# EAGLE schematic CubePCB (EAGLE 8.3.2)

## Sheet 1 of 4: LEDs
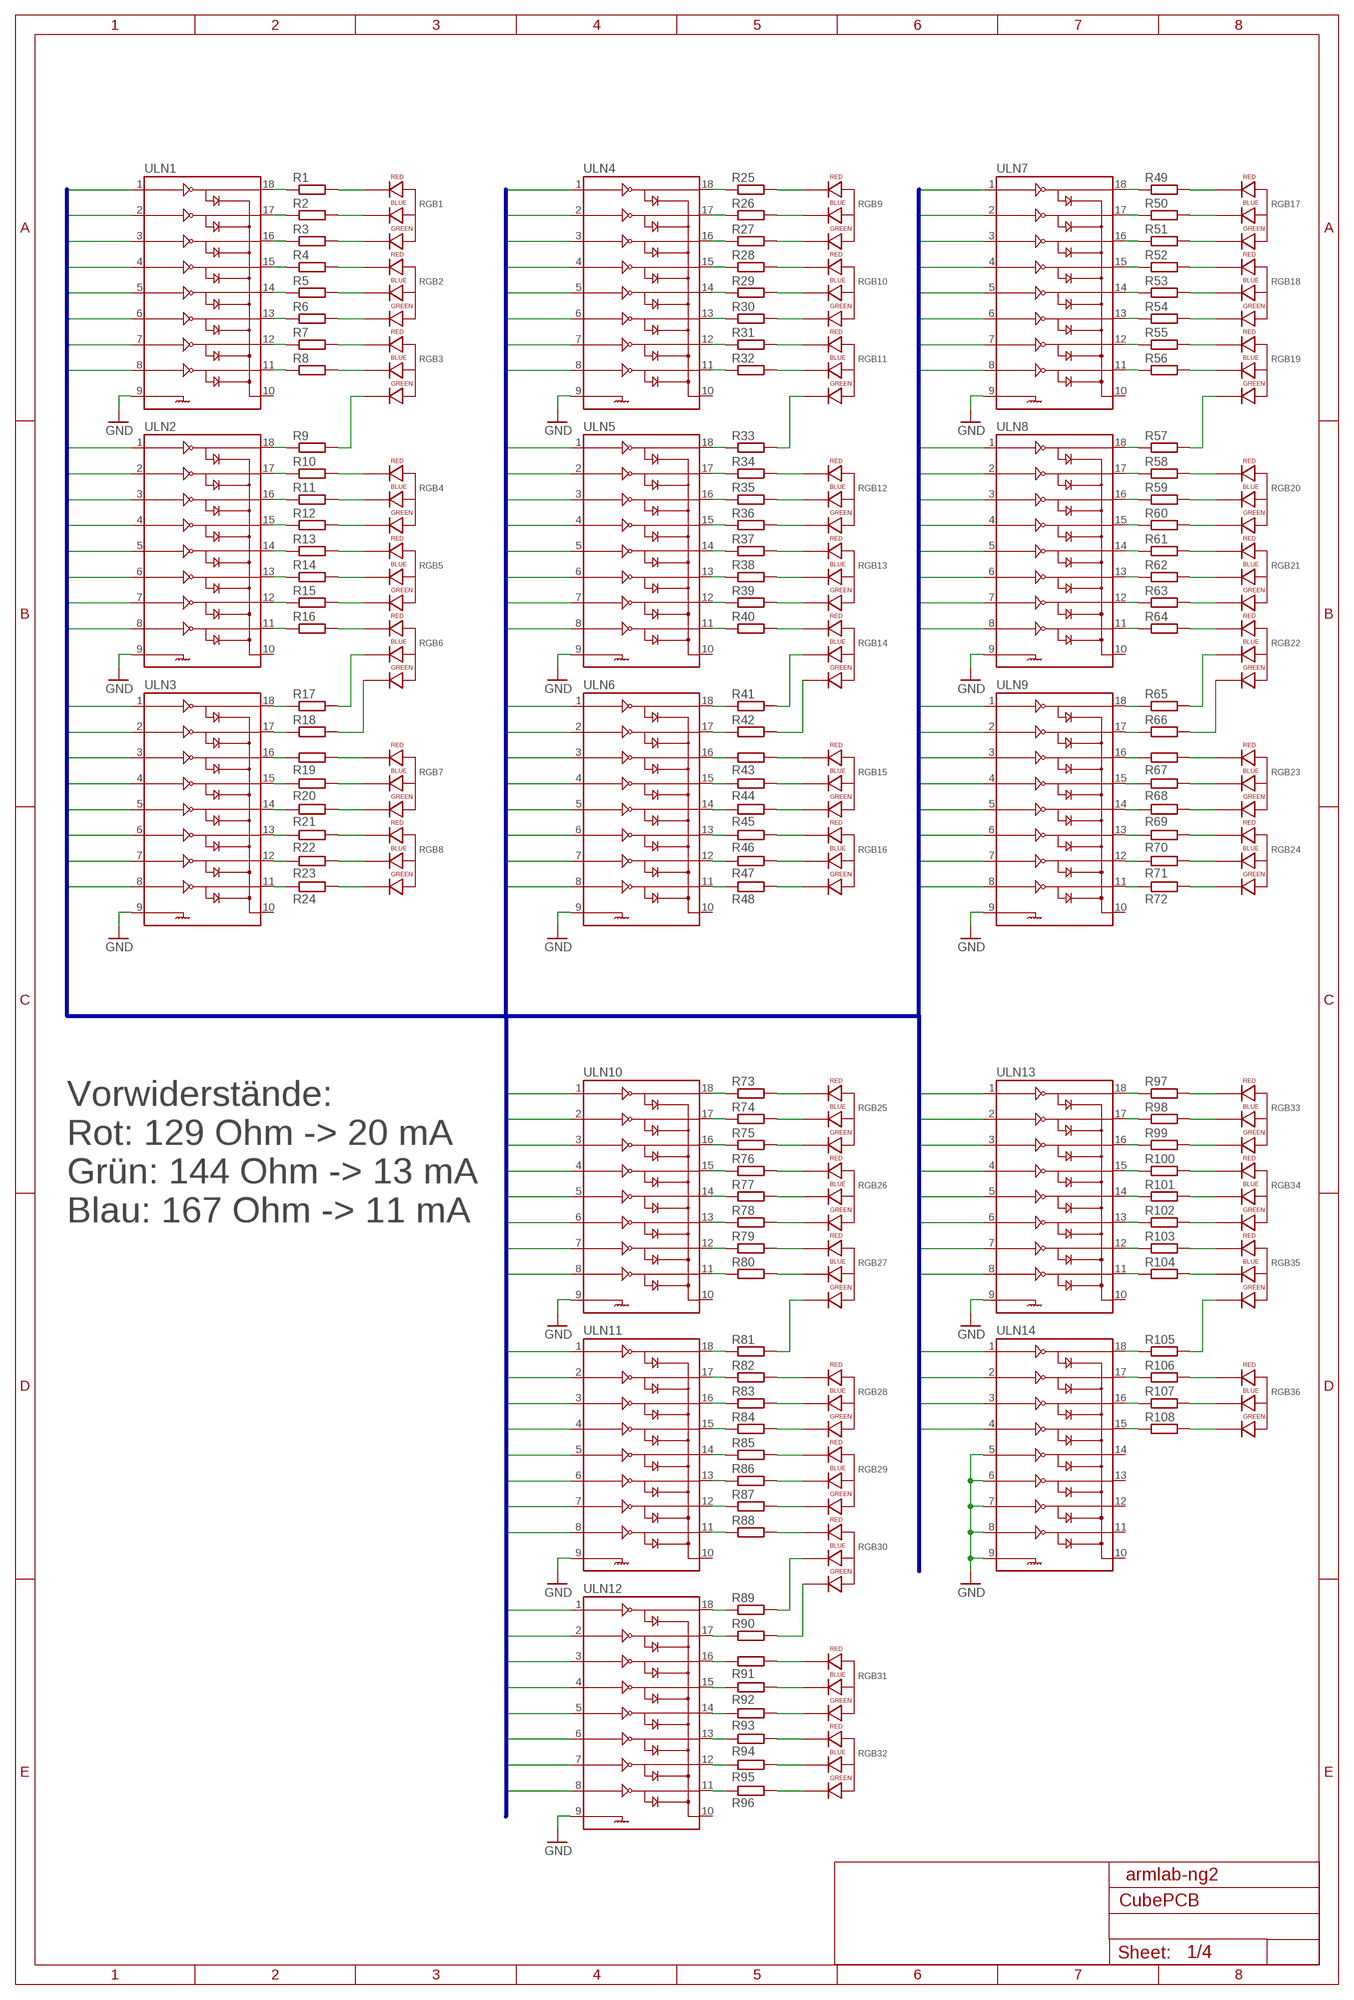
[diagram p0: schematic, sheet 1]

### Parts
R1  R-EU_R0603  [R0603]
R2  R-EU_R0603  [R0603]
R3  R-EU_R0603  [R0603]
R4  R-EU_R0603  [R0603]
R5  R-EU_R0603  [R0603]
R6  R-EU_R0603  [R0603]
R7  R-EU_R0603  [R0603]
R8  R-EU_R0603  [R0603]
R9  R-EU_R0603  [R0603]
R10  R-EU_R0603  [R0603]
R11  R-EU_R0603  [R0603]
R12  R-EU_R0603  [R0603]
R13  R-EU_R0603  [R0603]
R14  R-EU_R0603  [R0603]
R15  R-EU_R0603  [R0603]
R16  R-EU_R0603  [R0603]
R17  R-EU_R0603  [R0603]
R18  R-EU_R0603  [R0603]
R19  R-EU_R0603  [R0603]
R20  R-EU_R0603  [R0603]
R21  R-EU_R0603  [R0603]
R22  R-EU_R0603  [R0603]
R23  R-EU_R0603  [R0603]
R24  R-EU_R0603  [R0603]
R25  R-EU_R0603  [R0603]
R26  R-EU_R0603  [R0603]
R27  R-EU_R0603  [R0603]
R28  R-EU_R0603  [R0603]
R29  R-EU_R0603  [R0603]
R30  R-EU_R0603  [R0603]
R31  R-EU_R0603  [R0603]
R32  R-EU_R0603  [R0603]
R33  R-EU_R0603  [R0603]
R34  R-EU_R0603  [R0603]
R35  R-EU_R0603  [R0603]
R36  R-EU_R0603  [R0603]
R37  R-EU_R0603  [R0603]
R38  R-EU_R0603  [R0603]
R39  R-EU_R0603  [R0603]
R40  R-EU_R0603  [R0603]
R41  R-EU_R0603  [R0603]
R42  R-EU_R0603  [R0603]
R43  R-EU_R0603  [R0603]
R44  R-EU_R0603  [R0603]
R45  R-EU_R0603  [R0603]
R46  R-EU_R0603  [R0603]
R47  R-EU_R0603  [R0603]
R48  R-EU_R0603  [R0603]
R49  R-EU_R0603  [R0603]
R50  R-EU_R0603  [R0603]
R51  R-EU_R0603  [R0603]
R52  R-EU_R0603  [R0603]
R53  R-EU_R0603  [R0603]
R54  R-EU_R0603  [R0603]
R55  R-EU_R0603  [R0603]
R56  R-EU_R0603  [R0603]
R57  R-EU_R0603  [R0603]
R58  R-EU_R0603  [R0603]
R59  R-EU_R0603  [R0603]
R60  R-EU_R0603  [R0603]
R61  R-EU_R0603  [R0603]
R62  R-EU_R0603  [R0603]
R63  R-EU_R0603  [R0603]
R64  R-EU_R0603  [R0603]
R65  R-EU_R0603  [R0603]
R66  R-EU_R0603  [R0603]
R67  R-EU_R0603  [R0603]
R68  R-EU_R0603  [R0603]
R69  R-EU_R0603  [R0603]
R70  R-EU_R0603  [R0603]
R71  R-EU_R0603  [R0603]
R72  R-EU_R0603  [R0603]
R73  R-EU_R0603  [R0603]
R74  R-EU_R0603  [R0603]
R75  R-EU_R0603  [R0603]
R76  R-EU_R0603  [R0603]
R77  R-EU_R0603  [R0603]
R78  R-EU_R0603  [R0603]
R79  R-EU_R0603  [R0603]
R80  R-EU_R0603  [R0603]
R81  R-EU_R0603  [R0603]
R82  R-EU_R0603  [R0603]
R83  R-EU_R0603  [R0603]
R84  R-EU_R0603  [R0603]
R85  R-EU_R0603  [R0603]
R86  R-EU_R0603  [R0603]
R87  R-EU_R0603  [R0603]
R88  R-EU_R0603  [R0603]
R89  R-EU_R0603  [R0603]
R90  R-EU_R0603  [R0603]
R91  R-EU_R0603  [R0603]
R92  R-EU_R0603  [R0603]
R93  R-EU_R0603  [R0603]
R94  R-EU_R0603  [R0603]
R95  R-EU_R0603  [R0603]
R96  R-EU_R0603  [R0603]
R97  R-EU_R0603  [R0603]
R98  R-EU_R0603  [R0603]
R99  R-EU_R0603  [R0603]
R100  R-EU_R0603  [R0603]
R101  R-EU_R0603  [R0603]
R102  R-EU_R0603  [R0603]
R103  R-EU_R0603  [R0603]
R104  R-EU_R0603  [R0603]
R105  R-EU_R0603  [R0603]
R106  R-EU_R0603  [R0603]
R107  R-EU_R0603  [R0603]
R108  R-EU_R0603  [R0603]
RGB1  LED-RGB-CA-ANODE-SPLIT  [LED-RGB-WO-ANODE]
RGB2  LED-RGB-CA-ANODE-SPLIT  [LED-RGB-WO-ANODE]
RGB3  LED-RGB-CA-ANODE-SPLIT  [LED-RGB-WO-ANODE]
RGB4  LED-RGB-CA-ANODE-SPLIT  [LED-RGB-WO-ANODE]
RGB5  LED-RGB-CA-ANODE-SPLIT  [LED-RGB-WO-ANODE]
RGB6  LED-RGB-CA-ANODE-SPLIT  [LED-RGB-WO-ANODE]
RGB7  LED-RGB-CA-ANODE-SPLIT  [LED-RGB-WO-ANODE]
RGB8  LED-RGB-CA-ANODE-SPLIT  [LED-RGB-WO-ANODE]
RGB9  LED-RGB-CA-ANODE-SPLIT  [LED-RGB-WO-ANODE]
RGB10  LED-RGB-CA-ANODE-SPLIT  [LED-RGB-WO-ANODE]
RGB11  LED-RGB-CA-ANODE-SPLIT  [LED-RGB-WO-ANODE]
RGB12  LED-RGB-CA-ANODE-SPLIT  [LED-RGB-WO-ANODE]
RGB13  LED-RGB-CA-ANODE-SPLIT  [LED-RGB-WO-ANODE]
RGB14  LED-RGB-CA-ANODE-SPLIT  [LED-RGB-WO-ANODE]
RGB15  LED-RGB-CA-ANODE-SPLIT  [LED-RGB-WO-ANODE]
RGB16  LED-RGB-CA-ANODE-SPLIT  [LED-RGB-WO-ANODE]
RGB17  LED-RGB-CA-ANODE-SPLIT  [LED-RGB-WO-ANODE]
RGB18  LED-RGB-CA-ANODE-SPLIT  [LED-RGB-WO-ANODE]
RGB19  LED-RGB-CA-ANODE-SPLIT  [LED-RGB-WO-ANODE]
RGB20  LED-RGB-CA-ANODE-SPLIT  [LED-RGB-WO-ANODE]
RGB21  LED-RGB-CA-ANODE-SPLIT  [LED-RGB-WO-ANODE]
RGB22  LED-RGB-CA-ANODE-SPLIT  [LED-RGB-WO-ANODE]
RGB23  LED-RGB-CA-ANODE-SPLIT  [LED-RGB-WO-ANODE]
RGB24  LED-RGB-CA-ANODE-SPLIT  [LED-RGB-WO-ANODE]
RGB25  LED-RGB-CA-ANODE-SPLIT  [LED-RGB-WO-ANODE]
RGB26  LED-RGB-CA-ANODE-SPLIT  [LED-RGB-WO-ANODE]
RGB27  LED-RGB-CA-ANODE-SPLIT  [LED-RGB-WO-ANODE]
RGB28  LED-RGB-CA-ANODE-SPLIT  [LED-RGB-WO-ANODE]
RGB29  LED-RGB-CA-ANODE-SPLIT  [LED-RGB-WO-ANODE]
RGB30  LED-RGB-CA-ANODE-SPLIT  [LED-RGB-WO-ANODE]
RGB31  LED-RGB-CA-ANODE-SPLIT  [LED-RGB-WO-ANODE]
RGB32  LED-RGB-CA-ANODE-SPLIT  [LED-RGB-WO-ANODE]
RGB33  LED-RGB-CA-ANODE-SPLIT  [LED-RGB-WO-ANODE]
RGB34  LED-RGB-CA-ANODE-SPLIT  [LED-RGB-WO-ANODE]
RGB35  LED-RGB-CA-ANODE-SPLIT  [LED-RGB-WO-ANODE]
RGB36  LED-RGB-CA-ANODE-SPLIT  [LED-RGB-WO-ANODE]
ULN1  ULN2803SOICW  [SO18L]
ULN2  ULN2803SOICW  [SO18L]
ULN3  ULN2803SOICW  [SO18L]
ULN4  ULN2803SOICW  [SO18L]
ULN5  ULN2803SOICW  [SO18L]
ULN6  ULN2803SOICW  [SO18L]
ULN7  ULN2803SOICW  [SO18L]
ULN8  ULN2803SOICW  [SO18L]
ULN9  ULN2803SOICW  [SO18L]
ULN10  ULN2803SOICW  [SO18L]
ULN11  ULN2803SOICW  [SO18L]
ULN12  ULN2803SOICW  [SO18L]
ULN13  ULN2803SOICW  [SO18L]
ULN14  ULN2803SOICW  [SO18L]

### Nets
B1: ULN1.2 ; also sheet 3
B2: ULN1.5 ; also sheet 3
B3: ULN1.8 ; also sheet 3
B4: ULN2.3 ; also sheet 3
B5: ULN2.6 ; also sheet 3
B6: ULN3.1 ; also sheet 3
B7: ULN3.4 ; also sheet 3
B8: ULN3.7 ; also sheet 3
B9: ULN4.2 ; also sheet 3
B10: ULN4.5 ; also sheet 3
B11: ULN4.8 ; also sheet 3
B12: ULN5.3 ; also sheet 3
B13: ULN5.6 ; also sheet 3
B14: ULN6.1 ; also sheet 3
B15: ULN6.4 ; also sheet 3
B16: ULN6.7 ; also sheet 3
B17: ULN7.2 ; also sheet 3
B18: ULN7.5 ; also sheet 3
B19: ULN7.8 ; also sheet 3
B20: ULN8.3 ; also sheet 3
B21: ULN8.6 ; also sheet 3
B22: ULN9.1 ; also sheet 3
B23: ULN9.4 ; also sheet 3
B24: ULN9.7 ; also sheet 3
B25: ULN10.2 ; also sheet 3
B26: ULN10.5 ; also sheet 3
B27: ULN10.8 ; also sheet 3
B28: ULN11.3 ; also sheet 3
B29: ULN11.6 ; also sheet 3
B30: ULN12.1 ; also sheet 3
B31: ULN12.4 ; also sheet 3
B32: ULN12.7 ; also sheet 3
B33: ULN13.2 ; also sheet 3
B34: ULN13.5 ; also sheet 3
B35: ULN13.8 ; also sheet 3
B36: ULN14.3 ; also sheet 3
G1: ULN1.3 ; also sheet 3
G2: ULN1.6 ; also sheet 3
G3: ULN2.1 ; also sheet 3
G4: ULN2.4 ; also sheet 3
G5: ULN2.7 ; also sheet 3
G6: ULN3.2 ; also sheet 3
G7: ULN3.5 ; also sheet 3
G8: ULN3.8 ; also sheet 3
G9: ULN4.3 ; also sheet 3
G10: ULN4.6 ; also sheet 3
G11: ULN5.1 ; also sheet 3
G12: ULN5.4 ; also sheet 3
G13: ULN5.7 ; also sheet 3
G14: ULN6.2 ; also sheet 3
G15: ULN6.5 ; also sheet 3
G16: ULN6.8 ; also sheet 3
G17: ULN7.3 ; also sheet 3
G18: ULN7.6 ; also sheet 3
G19: ULN8.1 ; also sheet 3
G20: ULN8.4 ; also sheet 3
G21: ULN8.7 ; also sheet 3
G22: ULN9.2 ; also sheet 3
G23: ULN9.5 ; also sheet 3
G24: ULN9.8 ; also sheet 3
G25: ULN10.3 ; also sheet 3
G26: ULN10.6 ; also sheet 3
G27: ULN11.1 ; also sheet 3
G28: ULN11.4 ; also sheet 3
G29: ULN11.7 ; also sheet 3
G30: ULN12.2 ; also sheet 3
G31: ULN12.5 ; also sheet 3
G32: ULN12.8 ; also sheet 3
G33: ULN13.3 ; also sheet 3
G34: ULN13.6 ; also sheet 3
G35: ULN14.1 ; also sheet 3
G36: ULN14.4 ; also sheet 3
GND: ULN1.9 ULN2.9 ULN3.9 ULN4.9 ULN5.9 ULN6.9 ULN7.9 ULN8.9 ULN9.9 ULN10.9 ULN11.9 ULN12.9 ULN13.9 ULN14.5 ULN14.6 ULN14.7 ULN14.8 ULN14.9 ; also sheet 2,3,4
N$1: R1.1 ULN1.18
N$2: R2.1 ULN1.17
N$3: R3.1 ULN1.16
N$4: R3.2 RGB1.G(GREEN_CATHODE)
N$5: R2.2 RGB1.B(BLUE_CATHODE)
N$6: R1.2 RGB1.R(RED_CATHODE)
N$7: R4.1 ULN1.15
N$8: R5.1 ULN1.14
N$9: R6.1 ULN1.13
N$10: R7.1 ULN1.12
N$11: R6.2 RGB2.G(GREEN_CATHODE)
N$12: R5.2 RGB2.B(BLUE_CATHODE)
N$13: R4.2 RGB2.R(RED_CATHODE)
N$14: R8.1 ULN1.11
N$15: R19.1 ULN3.16
N$16: R20.1 ULN3.15
N$17: R9.2 RGB3.G(GREEN_CATHODE)
N$18: R8.2 RGB3.B(BLUE_CATHODE)
N$19: R7.2 RGB3.R(RED_CATHODE)
N$20: R21.1 ULN3.14
N$21: R22.1 ULN3.13
N$22: R23.1 ULN3.12
N$23: R12.2 RGB4.G(GREEN_CATHODE)
N$24: R11.2 RGB4.B(BLUE_CATHODE)
N$25: R10.2 RGB4.R(RED_CATHODE)
N$26: R24.1 ULN3.11
N$27: R27.2 RGB9.G(GREEN_CATHODE)
N$28: R26.2 RGB9.B(BLUE_CATHODE)
N$29: R15.2 RGB5.G(GREEN_CATHODE)
N$30: R14.2 RGB5.B(BLUE_CATHODE)
N$31: R13.2 RGB5.R(RED_CATHODE)
N$32: R25.2 RGB9.R(RED_CATHODE)
N$33: R30.2 RGB10.G(GREEN_CATHODE)
N$34: R29.2 RGB10.B(BLUE_CATHODE)
N$35: R18.2 RGB6.G(GREEN_CATHODE)
N$36: R17.2 RGB6.B(BLUE_CATHODE)
N$37: R16.2 RGB6.R(RED_CATHODE)
N$38: R28.2 RGB10.R(RED_CATHODE)
N$39: R33.2 RGB11.G(GREEN_CATHODE)
N$40: R32.2 RGB11.B(BLUE_CATHODE)
N$41: R31.2 RGB11.R(RED_CATHODE)
N$42: R36.2 RGB12.G(GREEN_CATHODE)
N$43: R35.2 RGB12.B(BLUE_CATHODE)
N$44: R34.2 RGB12.R(RED_CATHODE)
N$45: R19.2 RGB7.R(RED_CATHODE)
N$46: R20.2 RGB7.B(BLUE_CATHODE)
N$47: R21.2 RGB7.G(GREEN_CATHODE)
N$48: R22.2 RGB8.R(RED_CATHODE)
N$49: R23.2 RGB8.B(BLUE_CATHODE)
N$50: R24.2 RGB8.G(GREEN_CATHODE)
N$51: R39.2 RGB13.G(GREEN_CATHODE)
N$52: R38.2 RGB13.B(BLUE_CATHODE)
N$53: R9.1 ULN2.18
N$54: R10.1 ULN2.17
N$55: R11.1 ULN2.16
N$56: R12.1 ULN2.15
N$57: R13.1 ULN2.14
N$58: R14.1 ULN2.13
N$59: R15.1 ULN2.12
N$60: R16.1 ULN2.11
N$61: R17.1 ULN3.18
N$62: R18.1 ULN3.17
N$63: R37.2 RGB13.R(RED_CATHODE)
N$64: R42.2 RGB14.G(GREEN_CATHODE)
N$65: R41.2 RGB14.B(BLUE_CATHODE)
N$66: R40.2 RGB14.R(RED_CATHODE)
N$67: R25.1 ULN4.18
N$68: R26.1 ULN4.17
N$69: R27.1 ULN4.16
N$70: R28.1 ULN4.15
N$71: R29.1 ULN4.14
N$72: R30.1 ULN4.13
N$73: R31.1 ULN4.12
N$74: R32.1 ULN4.11
N$75: R33.1 ULN5.18
N$76: R34.1 ULN5.17
N$77: R35.1 ULN5.16
N$78: R36.1 ULN5.15
N$79: R37.1 ULN5.14
N$80: R38.1 ULN5.13
N$81: R39.1 ULN5.12
N$82: R40.1 ULN5.11
N$83: R41.1 ULN6.18
N$84: R42.1 ULN6.17
N$85: R43.1 ULN6.16
N$86: R44.1 ULN6.15
N$87: R45.1 ULN6.14
N$88: R46.1 ULN6.13
N$89: R47.1 ULN6.12
N$90: R48.1 ULN6.11
N$91: R43.2 RGB15.R(RED_CATHODE)
N$92: R44.2 RGB15.B(BLUE_CATHODE)
N$93: R45.2 RGB15.G(GREEN_CATHODE)
N$94: R46.2 RGB16.R(RED_CATHODE)
N$95: R47.2 RGB16.B(BLUE_CATHODE)
N$96: R48.2 RGB16.G(GREEN_CATHODE)
N$97: R51.2 RGB17.G(GREEN_CATHODE)
N$98: R50.2 RGB17.B(BLUE_CATHODE)
N$99: R49.2 RGB17.R(RED_CATHODE)
N$100: R54.2 RGB18.G(GREEN_CATHODE)
N$101: R53.2 RGB18.B(BLUE_CATHODE)
N$102: R52.2 RGB18.R(RED_CATHODE)
N$103: R57.2 RGB19.G(GREEN_CATHODE)
N$104: R56.2 RGB19.B(BLUE_CATHODE)
N$105: R55.2 RGB19.R(RED_CATHODE)
N$106: R60.2 RGB20.G(GREEN_CATHODE)
N$107: R59.2 RGB20.B(BLUE_CATHODE)
N$108: R58.2 RGB20.R(RED_CATHODE)
N$109: R63.2 RGB21.G(GREEN_CATHODE)
N$110: R62.2 RGB21.B(BLUE_CATHODE)
N$111: R61.2 RGB21.R(RED_CATHODE)
N$112: R66.2 RGB22.G(GREEN_CATHODE)
N$113: R65.2 RGB22.B(BLUE_CATHODE)
N$114: R64.2 RGB22.R(RED_CATHODE)
N$115: R49.1 ULN7.18
N$116: R50.1 ULN7.17
N$117: R51.1 ULN7.16
N$118: R52.1 ULN7.15
N$119: R53.1 ULN7.14
N$120: R54.1 ULN7.13
N$121: R55.1 ULN7.12
N$122: R56.1 ULN7.11
N$123: R57.1 ULN8.18
N$124: R58.1 ULN8.17
N$125: R59.1 ULN8.16
N$126: R60.1 ULN8.15
N$127: R61.1 ULN8.14
N$128: R62.1 ULN8.13
N$129: R63.1 ULN8.12
N$130: R64.1 ULN8.11
N$131: R65.1 ULN9.18
N$132: R66.1 ULN9.17
N$133: R67.1 ULN9.16
N$134: R68.1 ULN9.15
N$135: R69.1 ULN9.14
N$136: R70.1 ULN9.13
N$137: R71.1 ULN9.12
N$138: R72.1 ULN9.11
N$139: R67.2 RGB23.R(RED_CATHODE)
N$140: R68.2 RGB23.B(BLUE_CATHODE)
N$141: R69.2 RGB23.G(GREEN_CATHODE)
N$142: R70.2 RGB24.R(RED_CATHODE)
N$143: R71.2 RGB24.B(BLUE_CATHODE)
N$144: R72.2 RGB24.G(GREEN_CATHODE)
N$145: R75.2 RGB25.G(GREEN_CATHODE)
N$146: R74.2 RGB25.B(BLUE_CATHODE)
N$147: R73.2 RGB25.R(RED_CATHODE)
N$148: R78.2 RGB26.G(GREEN_CATHODE)
N$149: R77.2 RGB26.B(BLUE_CATHODE)
N$150: R76.2 RGB26.R(RED_CATHODE)
N$151: R81.2 RGB27.G(GREEN_CATHODE)
N$152: R80.2 RGB27.B(BLUE_CATHODE)
N$153: R79.2 RGB27.R(RED_CATHODE)
N$154: R84.2 RGB28.G(GREEN_CATHODE)
N$155: R83.2 RGB28.B(BLUE_CATHODE)
N$156: R82.2 RGB28.R(RED_CATHODE)
N$157: R87.2 RGB29.G(GREEN_CATHODE)
N$158: R86.2 RGB29.B(BLUE_CATHODE)
N$159: R85.2 RGB29.R(RED_CATHODE)
N$160: R90.2 RGB30.G(GREEN_CATHODE)
N$161: R89.2 RGB30.B(BLUE_CATHODE)
N$162: R88.2 RGB30.R(RED_CATHODE)
N$163: R73.1 ULN10.18
N$164: R74.1 ULN10.17
N$165: R75.1 ULN10.16
N$166: R76.1 ULN10.15
N$167: R77.1 ULN10.14
N$168: R78.1 ULN10.13
N$169: R79.1 ULN10.12
N$170: R80.1 ULN10.11
N$171: R81.1 ULN11.18
N$172: R82.1 ULN11.17
N$173: R83.1 ULN11.16
N$174: R84.1 ULN11.15
N$175: R85.1 ULN11.14
N$176: R86.1 ULN11.13
N$177: R87.1 ULN11.12
N$178: R88.1 ULN11.11
N$179: R89.1 ULN12.18
N$180: R90.1 ULN12.17
N$181: R91.1 ULN12.16
N$182: R92.1 ULN12.15
N$183: R93.1 ULN12.14
N$184: R94.1 ULN12.13
N$185: R95.1 ULN12.12
N$186: R96.1 ULN12.11
N$187: R91.2 RGB31.R(RED_CATHODE)
N$188: R92.2 RGB31.B(BLUE_CATHODE)
N$189: R93.2 RGB31.G(GREEN_CATHODE)
N$190: R94.2 RGB32.R(RED_CATHODE)
N$191: R95.2 RGB32.B(BLUE_CATHODE)
N$192: R96.2 RGB32.G(GREEN_CATHODE)
N$193: R99.2 RGB33.G(GREEN_CATHODE)
N$194: R98.2 RGB33.B(BLUE_CATHODE)
N$195: R97.2 RGB33.R(RED_CATHODE)
N$196: R102.2 RGB34.G(GREEN_CATHODE)
N$197: R101.2 RGB34.B(BLUE_CATHODE)
N$198: R100.2 RGB34.R(RED_CATHODE)
N$199: R105.2 RGB35.G(GREEN_CATHODE)
N$200: R104.2 RGB35.B(BLUE_CATHODE)
N$201: R103.2 RGB35.R(RED_CATHODE)
N$202: R108.2 RGB36.G(GREEN_CATHODE)
N$203: R107.2 RGB36.B(BLUE_CATHODE)
N$204: R106.2 RGB36.R(RED_CATHODE)
N$211: R97.1 ULN13.18
N$212: R98.1 ULN13.17
N$213: R99.1 ULN13.16
N$214: R100.1 ULN13.15
N$215: R101.1 ULN13.14
N$216: R102.1 ULN13.13
N$217: R103.1 ULN13.12
N$218: R104.1 ULN13.11
N$219: R105.1 ULN14.18
N$220: R106.1 ULN14.17
N$221: R107.1 ULN14.16
N$222: R108.1 ULN14.15
R1: ULN1.1 ; also sheet 3
R2: ULN1.4 ; also sheet 3
R3: ULN1.7 ; also sheet 3
R4: ULN2.2 ; also sheet 3
R5: ULN2.5 ; also sheet 3
R6: ULN2.8 ; also sheet 3
R7: ULN3.3 ; also sheet 3
R8: ULN3.6 ; also sheet 3
R9: ULN4.1 ; also sheet 3
R10: ULN4.4 ; also sheet 3
R11: ULN4.7 ; also sheet 3
R12: ULN5.2 ; also sheet 3
R13: ULN5.5 ; also sheet 3
R14: ULN5.8 ; also sheet 3
R15: ULN6.3 ; also sheet 3
R16: ULN6.6 ; also sheet 3
R17: ULN7.1 ; also sheet 3
R18: ULN7.4 ; also sheet 3
R19: ULN7.7 ; also sheet 3
R20: ULN8.2 ; also sheet 3
R21: ULN8.5 ; also sheet 3
R22: ULN8.8 ; also sheet 3
R23: ULN9.3 ; also sheet 3
R24: ULN9.6 ; also sheet 3
R25: ULN10.1 ; also sheet 3
R26: ULN10.4 ; also sheet 3
R27: ULN10.7 ; also sheet 3
R28: ULN11.2 ; also sheet 3
R29: ULN11.5 ; also sheet 3
R30: ULN11.8 ; also sheet 3
R31: ULN12.3 ; also sheet 3
R32: ULN12.6 ; also sheet 3
R33: ULN13.1 ; also sheet 3
R34: ULN13.4 ; also sheet 3
R35: ULN13.7 ; also sheet 3
R36: ULN14.2 ; also sheet 3
Unconnected: ULN1.10 ULN2.10 ULN3.10 ULN4.10 ULN5.10 ULN6.10 ULN7.10 ULN8.10 ULN9.10 ULN10.10 ULN11.10 ULN12.10 ULN13.10 ULN14.10 ULN14.11 ULN14.12 ULN14.13 ULN14.14

### Buses
LED_BUS:R[1..36],G[1..36],B[1..36],+5V,GND

### Notes on the sheet
- Vorwiderstände:
  Rot: 129 Ohm -> 20 mA
  Grün: 144 Ohm -> 13 mA
  Blau: 167 Ohm -> 11 mA
- armlab-ng2

## Sheet 2 of 4: Ebenen
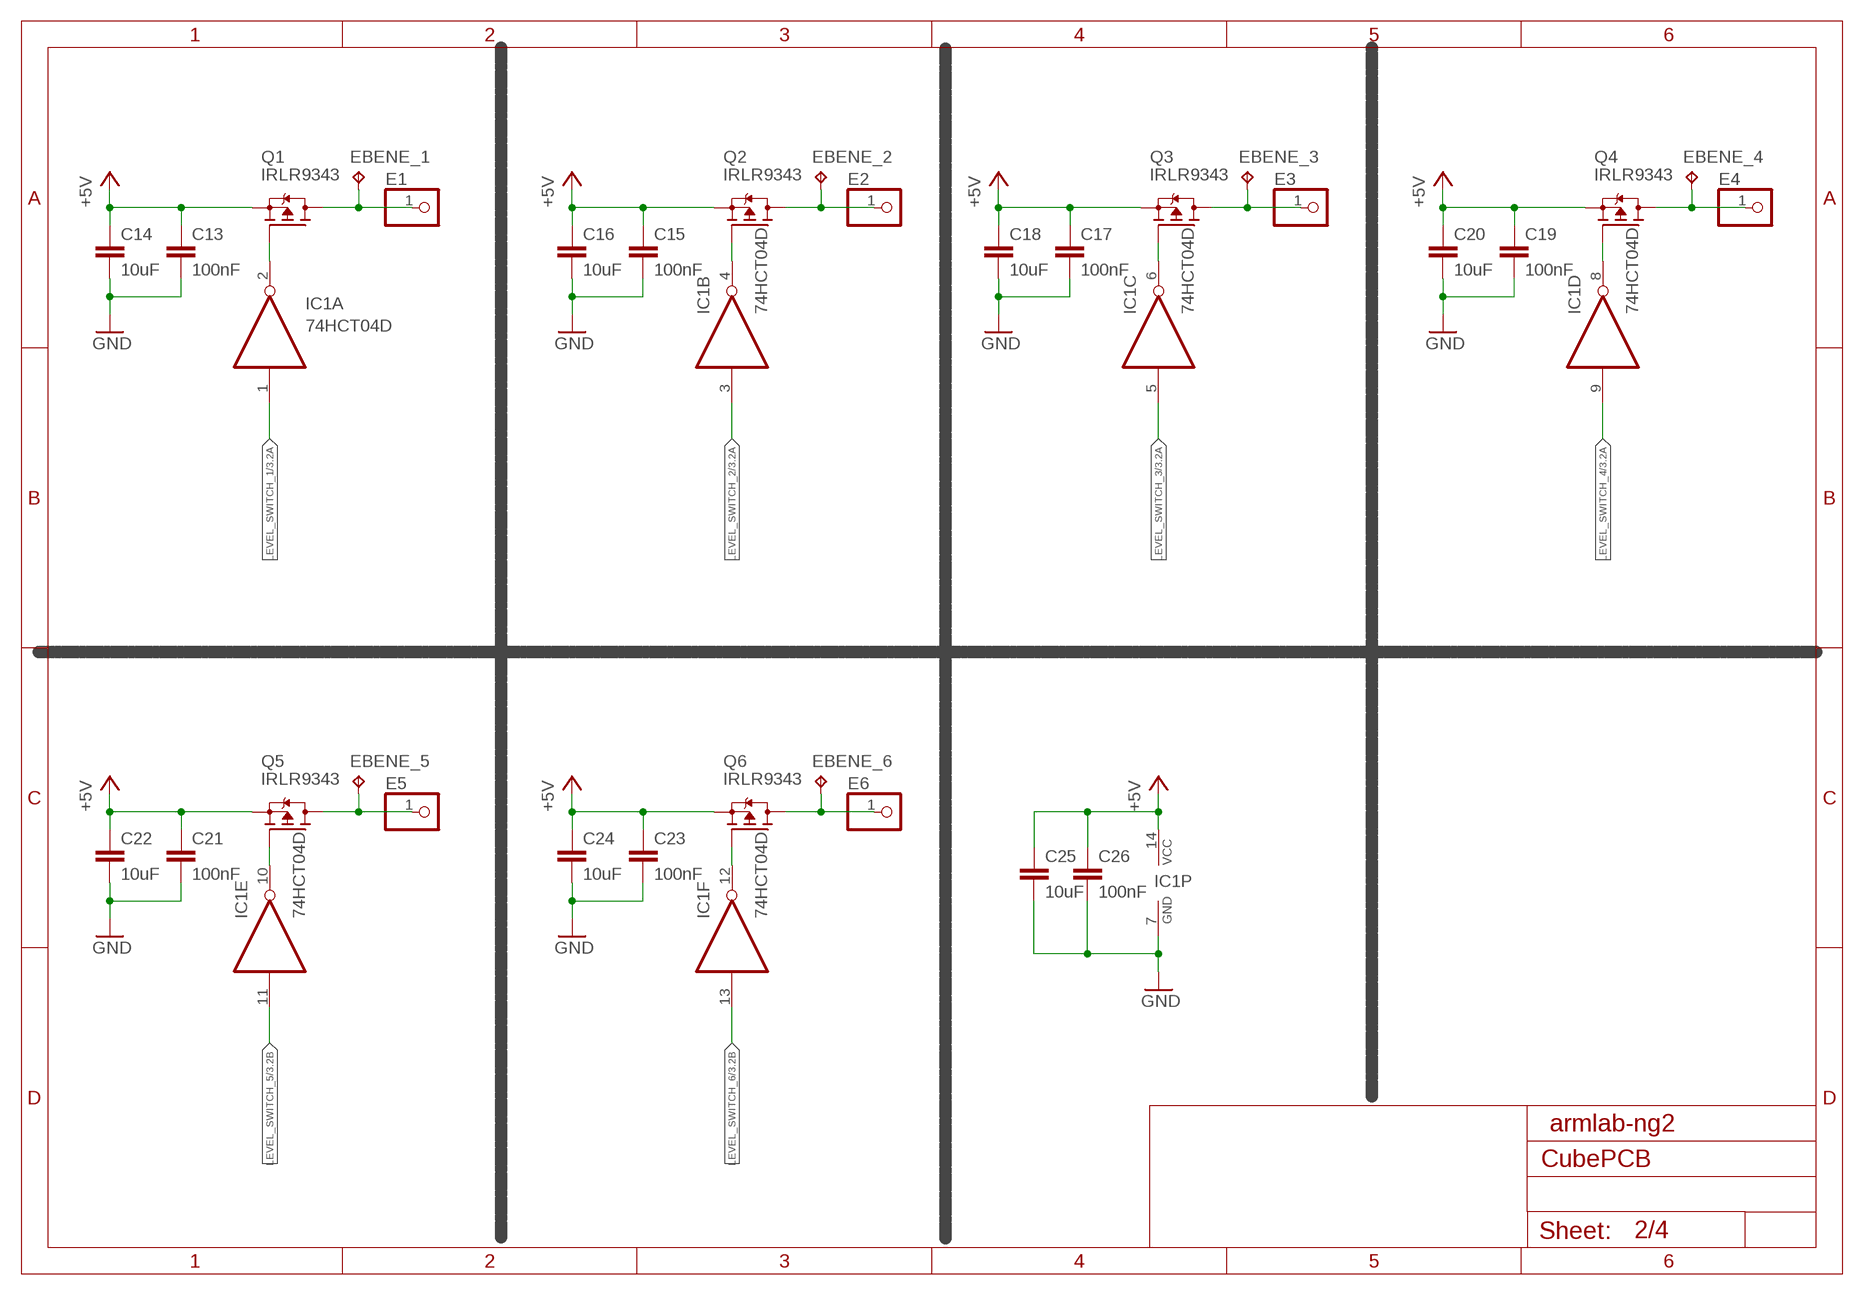
[diagram p1: schematic, sheet 2]

### Parts
C13  100nF  C-EUC0603K  [C0603K]
C14  10uF  C-EUC0603K  [C0603K]
C15  100nF  C-EUC0603K  [C0603K]
C16  10uF  C-EUC0603K  [C0603K]
C17  100nF  C-EUC0603K  [C0603K]
C18  10uF  C-EUC0603K  [C0603K]
C19  100nF  C-EUC0603K  [C0603K]
C20  10uF  C-EUC0603K  [C0603K]
C21  100nF  C-EUC0603K  [C0603K]
C22  10uF  C-EUC0603K  [C0603K]
C23  100nF  C-EUC0603K  [C0603K]
C24  10uF  C-EUC0603K  [C0603K]
C25  10uF  C-EUC0603K  [C0603K]
C26  100nF  C-EUC0603K  [C0603K]
E1  PINHD-1X1/LONG  [1X01]
E2  PINHD-1X1/LONG  [1X01]
E3  PINHD-1X1/LONG  [1X01]
E4  PINHD-1X1/LONG  [1X01]
E5  PINHD-1X1/LONG  [1X01]
E6  PINHD-1X1/LONG  [1X01]
EBENE_1  TPB1,27  [B1,27]
EBENE_2  TPB1,27  [B1,27]
EBENE_3  TPB1,27  [B1,27]
EBENE_4  TPB1,27  [B1,27]
EBENE_5  TPB1,27  [B1,27]
EBENE_6  TPB1,27  [B1,27]
IC1  74HCT04D  [SO14]
Q1  IRLR9343  FDD4141TO252  [TO252]
Q2  IRLR9343  FDD4141TO252  [TO252]
Q3  IRLR9343  FDD4141TO252  [TO252]
Q4  IRLR9343  FDD4141TO252  [TO252]
Q5  IRLR9343  FDD4141TO252  [TO252]
Q6  IRLR9343  FDD4141TO252  [TO252]

### Nets
+5V: C13.1 C14.1 C15.1 C16.1 C17.1 C18.1 C19.1 C20.1 C21.1 C22.1 C23.1 C24.1 C25.1 C26.1 IC1.14(P:VCC) Q1.2(S) Q2.2(S) Q3.2(S) Q4.2(S) Q5.2(S) Q6.2(S) ; also sheet 4
EBENE_1: E1.1 EBENE_1.TP Q1.3(D)
EBENE_2: E2.1 EBENE_2.TP Q2.3(D)
EBENE_3: E3.1 EBENE_3.TP Q3.3(D)
EBENE_4: E4.1 EBENE_4.TP Q4.3(D)
EBENE_5: E5.1 EBENE_5.TP Q5.3(D)
EBENE_6: E6.1 EBENE_6.TP Q6.3(D)
GND: C13.2 C14.2 C15.2 C16.2 C17.2 C18.2 C19.2 C20.2 C21.2 C22.2 C23.2 C24.2 C25.2 C26.2 IC1.7(P:GND) ; also sheet 1,3,4
LEVEL_SWITCH_1: IC1.1(A:I) ; also sheet 3
LEVEL_SWITCH_2: IC1.3(B:I) ; also sheet 3
LEVEL_SWITCH_3: IC1.5(C:I) ; also sheet 3
LEVEL_SWITCH_4: IC1.9(D:I) ; also sheet 3
LEVEL_SWITCH_5: IC1.11(E:I) ; also sheet 3
LEVEL_SWITCH_6: IC1.13(F:I) ; also sheet 3
N$205: IC1.4(B:O) Q2.1(G)
N$206: IC1.2(A:O) Q1.1(G)
N$207: IC1.6(C:O) Q3.1(G)
N$208: IC1.8(D:O) Q4.1(G)
N$209: IC1.10(E:O) Q5.1(G)
N$210: IC1.12(F:O) Q6.1(G)

### Notes on the sheet
- armlab-ng2

## Sheet 3 of 4: Connectoren
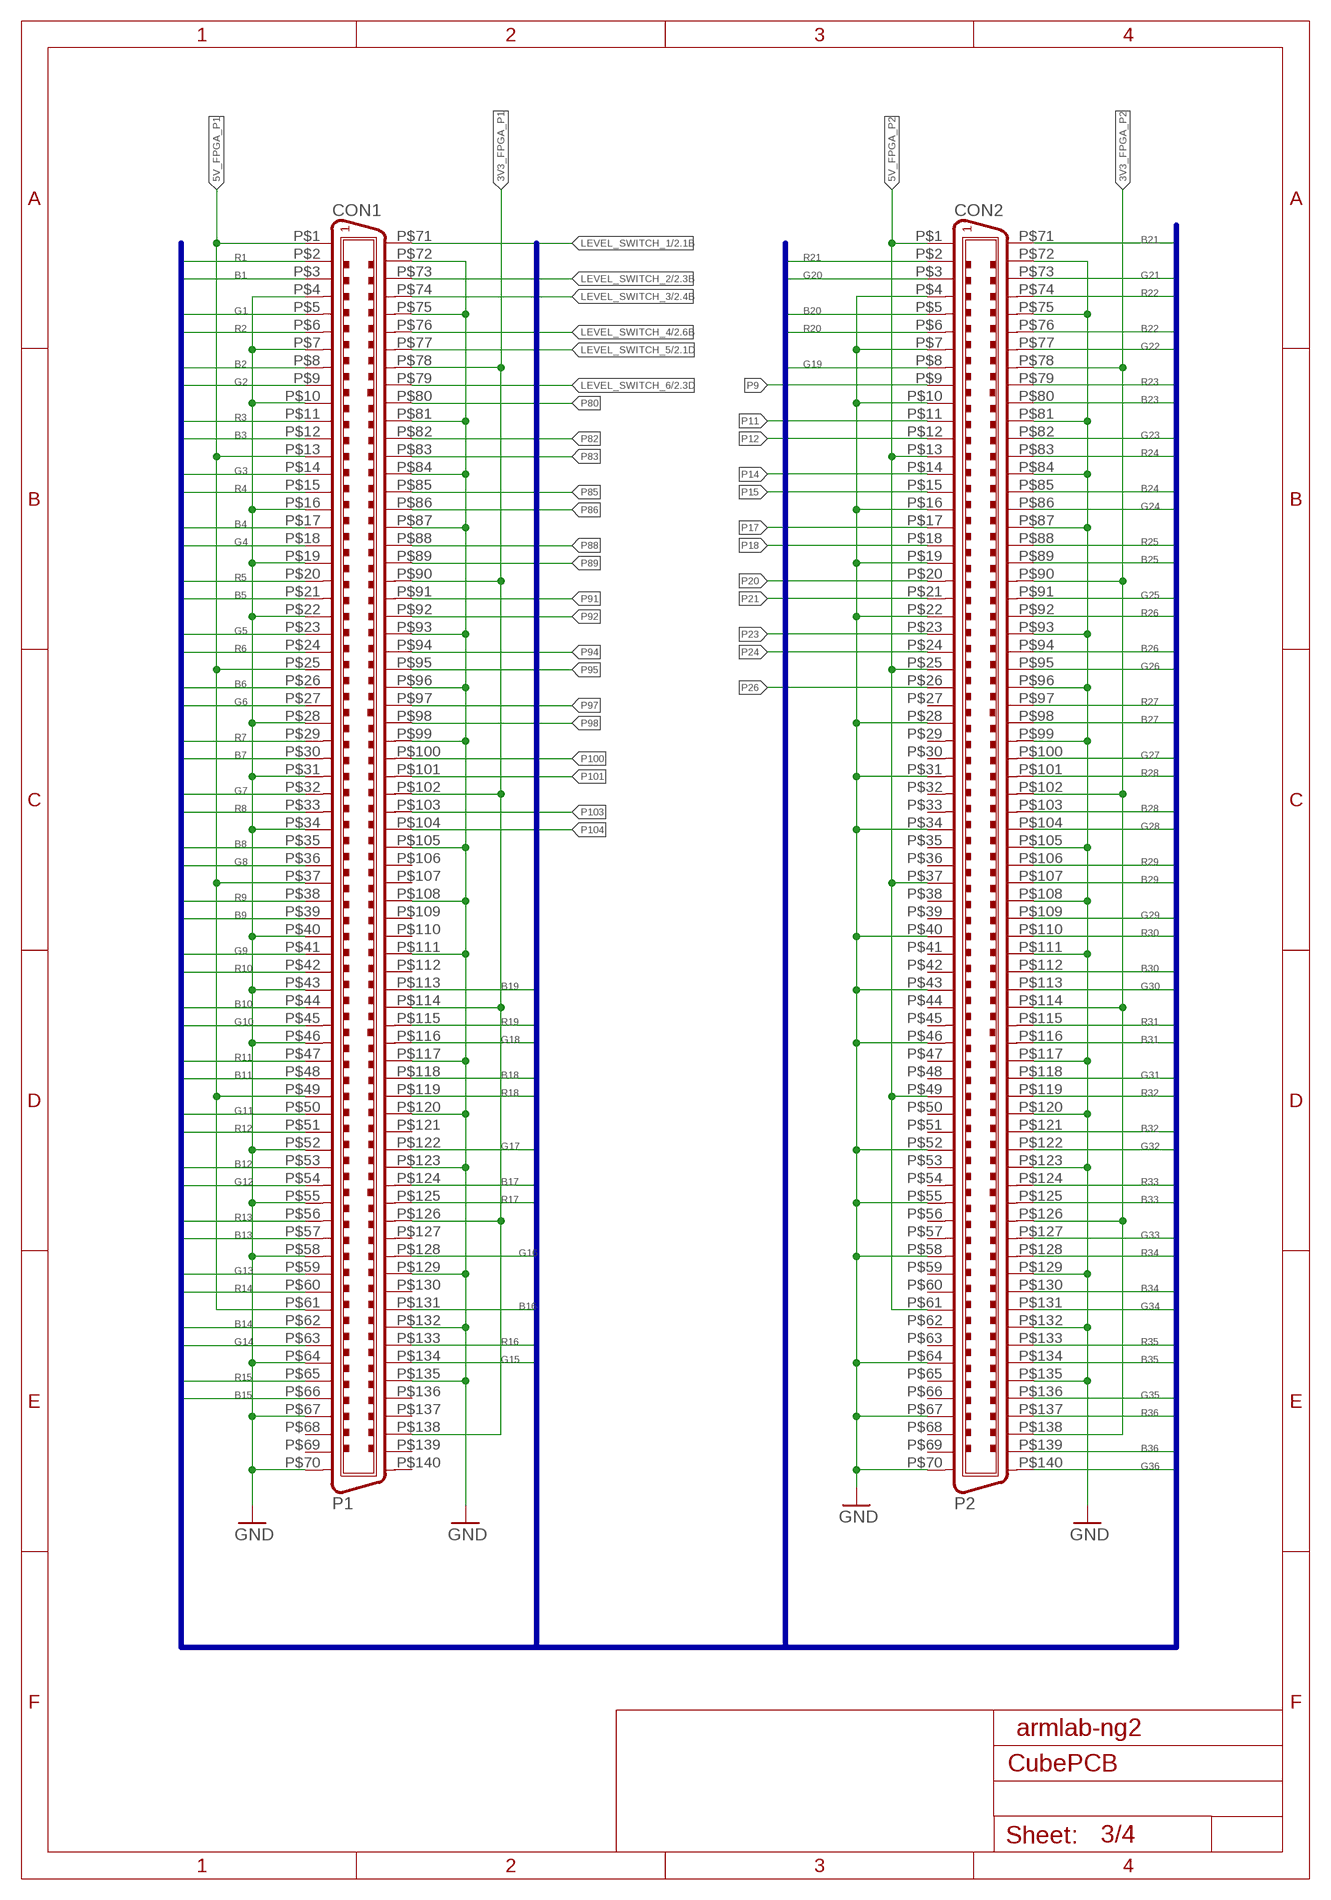
[diagram p2: schematic, sheet 3]

### Parts
CON1  P1  AVBUS_CONNECTOR_140-2  [140-FH0.8]
CON2  P2  AVBUS_CONNECTOR_140-2  [140-FH0.8]

### Nets
3V3_FPGA_P1: CON1.P$78 CON1.P$90 CON1.P$102 CON1.P$114 CON1.P$126 CON1.P$138
3V3_FPGA_P2: CON2.P$78 CON2.P$90 CON2.P$102 CON2.P$114 CON2.P$126 CON2.P$138
5V_FPGA_P1: CON1.P$1 CON1.P$13 CON1.P$25 CON1.P$37 CON1.P$49 CON1.P$61
5V_FPGA_P2: CON2.P$1 CON2.P$13 CON2.P$25 CON2.P$37 CON2.P$49 CON2.P$61
B1: CON1.P$3 ; also sheet 1
B2: CON1.P$8 ; also sheet 1
B3: CON1.P$12 ; also sheet 1
B4: CON1.P$17 ; also sheet 1
B5: CON1.P$21 ; also sheet 1
B6: CON1.P$26 ; also sheet 1
B7: CON1.P$30 ; also sheet 1
B8: CON1.P$35 ; also sheet 1
B9: CON1.P$39 ; also sheet 1
B10: CON1.P$44 ; also sheet 1
B11: CON1.P$48 ; also sheet 1
B12: CON1.P$53 ; also sheet 1
B13: CON1.P$57 ; also sheet 1
B14: CON1.P$62 ; also sheet 1
B15: CON1.P$66 ; also sheet 1
B16: CON1.P$131 ; also sheet 1
B17: CON1.P$124 ; also sheet 1
B18: CON1.P$118 ; also sheet 1
B19: CON1.P$113 ; also sheet 1
B20: CON2.P$5 ; also sheet 1
B21: CON2.P$71 ; also sheet 1
B22: CON2.P$76 ; also sheet 1
B23: CON2.P$80 ; also sheet 1
B24: CON2.P$85 ; also sheet 1
B25: CON2.P$89 ; also sheet 1
B26: CON2.P$94 ; also sheet 1
B27: CON2.P$98 ; also sheet 1
B28: CON2.P$103 ; also sheet 1
B29: CON2.P$107 ; also sheet 1
B30: CON2.P$112 ; also sheet 1
B31: CON2.P$116 ; also sheet 1
B32: CON2.P$121 ; also sheet 1
B33: CON2.P$125 ; also sheet 1
B34: CON2.P$130 ; also sheet 1
B35: CON2.P$134 ; also sheet 1
B36: CON2.P$139 ; also sheet 1
G1: CON1.P$5 ; also sheet 1
G2: CON1.P$9 ; also sheet 1
G3: CON1.P$14 ; also sheet 1
G4: CON1.P$18 ; also sheet 1
G5: CON1.P$23 ; also sheet 1
G6: CON1.P$27 ; also sheet 1
G7: CON1.P$32 ; also sheet 1
G8: CON1.P$36 ; also sheet 1
G9: CON1.P$41 ; also sheet 1
G10: CON1.P$45 ; also sheet 1
G11: CON1.P$50 ; also sheet 1
G12: CON1.P$54 ; also sheet 1
G13: CON1.P$59 ; also sheet 1
G14: CON1.P$63 ; also sheet 1
G15: CON1.P$134 ; also sheet 1
G16: CON1.P$128 ; also sheet 1
G17: CON1.P$122 ; also sheet 1
G18: CON1.P$116 ; also sheet 1
G19: CON2.P$8 ; also sheet 1
G20: CON2.P$3 ; also sheet 1
G21: CON2.P$73 ; also sheet 1
G22: CON2.P$77 ; also sheet 1
G23: CON2.P$82 ; also sheet 1
G24: CON2.P$86 ; also sheet 1
G25: CON2.P$91 ; also sheet 1
G26: CON2.P$95 ; also sheet 1
G27: CON2.P$100 ; also sheet 1
G28: CON2.P$104 ; also sheet 1
G29: CON2.P$109 ; also sheet 1
G30: CON2.P$113 ; also sheet 1
G31: CON2.P$118 ; also sheet 1
G32: CON2.P$122 ; also sheet 1
G33: CON2.P$127 ; also sheet 1
G34: CON2.P$131 ; also sheet 1
G35: CON2.P$136 ; also sheet 1
G36: CON2.P$140 ; also sheet 1
GND: CON1.P$4 CON1.P$7 CON1.P$10 CON1.P$16 CON1.P$19 CON1.P$22 CON1.P$28 CON1.P$31 CON1.P$34 CON1.P$40 CON1.P$43 CON1.P$46 CON1.P$52 CON1.P$55 CON1.P$58 CON1.P$64 CON1.P$67 CON1.P$70 CON1.P$72 CON1.P$75 CON1.P$81 CON1.P$84 CON1.P$87 CON1.P$93 CON1.P$96 CON1.P$99 CON1.P$105 CON1.P$108 CON1.P$111 CON1.P$117 CON1.P$120 CON1.P$123 CON1.P$129 CON1.P$132 CON1.P$135 CON2.P$4 CON2.P$7 CON2.P$10 CON2.P$16 CON2.P$19 CON2.P$22 CON2.P$28 CON2.P$31 CON2.P$34 CON2.P$40 CON2.P$43 CON2.P$46 CON2.P$52 CON2.P$55 CON2.P$58 CON2.P$64 CON2.P$67 CON2.P$70 CON2.P$72 CON2.P$75 CON2.P$81 CON2.P$84 CON2.P$87 CON2.P$93 CON2.P$96 CON2.P$99 CON2.P$105 CON2.P$108 CON2.P$111 CON2.P$117 CON2.P$120 CON2.P$123 CON2.P$129 CON2.P$132 CON2.P$135 ; also sheet 1,2,4
LEVEL_SWITCH_1: CON1.P$71 ; also sheet 2
LEVEL_SWITCH_2: CON1.P$73 ; also sheet 2
LEVEL_SWITCH_3: CON1.P$74 ; also sheet 2
LEVEL_SWITCH_4: CON1.P$76 ; also sheet 2
LEVEL_SWITCH_5: CON1.P$77 ; also sheet 2
LEVEL_SWITCH_6: CON1.P$79 ; also sheet 2
P9: CON2.P$9
P11: CON2.P$11
P12: CON2.P$12
P14: CON2.P$14
P15: CON2.P$15
P17: CON2.P$17
P18: CON2.P$18
P20: CON2.P$20
P21: CON2.P$21
P23: CON2.P$23
P24: CON2.P$24
P26: CON2.P$26
P80: CON1.P$80
P82: CON1.P$82
P83: CON1.P$83
P85: CON1.P$85
P86: CON1.P$86
P88: CON1.P$88
P89: CON1.P$89
P91: CON1.P$91
P92: CON1.P$92
P94: CON1.P$94
P95: CON1.P$95
P97: CON1.P$97
P98: CON1.P$98
P100: CON1.P$100
P101: CON1.P$101
P103: CON1.P$103
P104: CON1.P$104
R1: CON1.P$2 ; also sheet 1
R2: CON1.P$6 ; also sheet 1
R3: CON1.P$11 ; also sheet 1
R4: CON1.P$15 ; also sheet 1
R5: CON1.P$20 ; also sheet 1
R6: CON1.P$24 ; also sheet 1
R7: CON1.P$29 ; also sheet 1
R8: CON1.P$33 ; also sheet 1
R9: CON1.P$38 ; also sheet 1
R10: CON1.P$42 ; also sheet 1
R11: CON1.P$47 ; also sheet 1
R12: CON1.P$51 ; also sheet 1
R13: CON1.P$56 ; also sheet 1
R14: CON1.P$60 ; also sheet 1
R15: CON1.P$65 ; also sheet 1
R16: CON1.P$133 ; also sheet 1
R17: CON1.P$125 ; also sheet 1
R18: CON1.P$119 ; also sheet 1
R19: CON1.P$115 ; also sheet 1
R20: CON2.P$6 ; also sheet 1
R21: CON2.P$2 ; also sheet 1
R22: CON2.P$74 ; also sheet 1
R23: CON2.P$79 ; also sheet 1
R24: CON2.P$83 ; also sheet 1
R25: CON2.P$88 ; also sheet 1
R26: CON2.P$92 ; also sheet 1
R27: CON2.P$97 ; also sheet 1
R28: CON2.P$101 ; also sheet 1
R29: CON2.P$106 ; also sheet 1
R30: CON2.P$110 ; also sheet 1
R31: CON2.P$115 ; also sheet 1
R32: CON2.P$119 ; also sheet 1
R33: CON2.P$124 ; also sheet 1
R34: CON2.P$128 ; also sheet 1
R35: CON2.P$133 ; also sheet 1
R36: CON2.P$137 ; also sheet 1
Unconnected: CON1.P$68 CON1.P$69 CON1.P$106 CON1.P$107 CON1.P$109 CON1.P$110 CON1.P$112 CON1.P$121 CON1.P$127 CON1.P$130 CON1.P$136 CON1.P$137 CON1.P$139 CON1.P$140 CON2.P$27 CON2.P$29 CON2.P$30 CON2.P$32 CON2.P$33 CON2.P$35 CON2.P$36 CON2.P$38 CON2.P$39 CON2.P$41 CON2.P$42 CON2.P$44 CON2.P$45 CON2.P$47 CON2.P$48 CON2.P$50 CON2.P$51 CON2.P$53 CON2.P$54 CON2.P$56 CON2.P$57 CON2.P$59 CON2.P$60 CON2.P$62 CON2.P$63 CON2.P$65 CON2.P$66 CON2.P$68 CON2.P$69

### Buses
LED_BUS:R[1..36],G[1..36],B[1..36],+5V,GND

### Notes on the sheet
- armlab-ng2

## Sheet 4 of 4: Power Supply
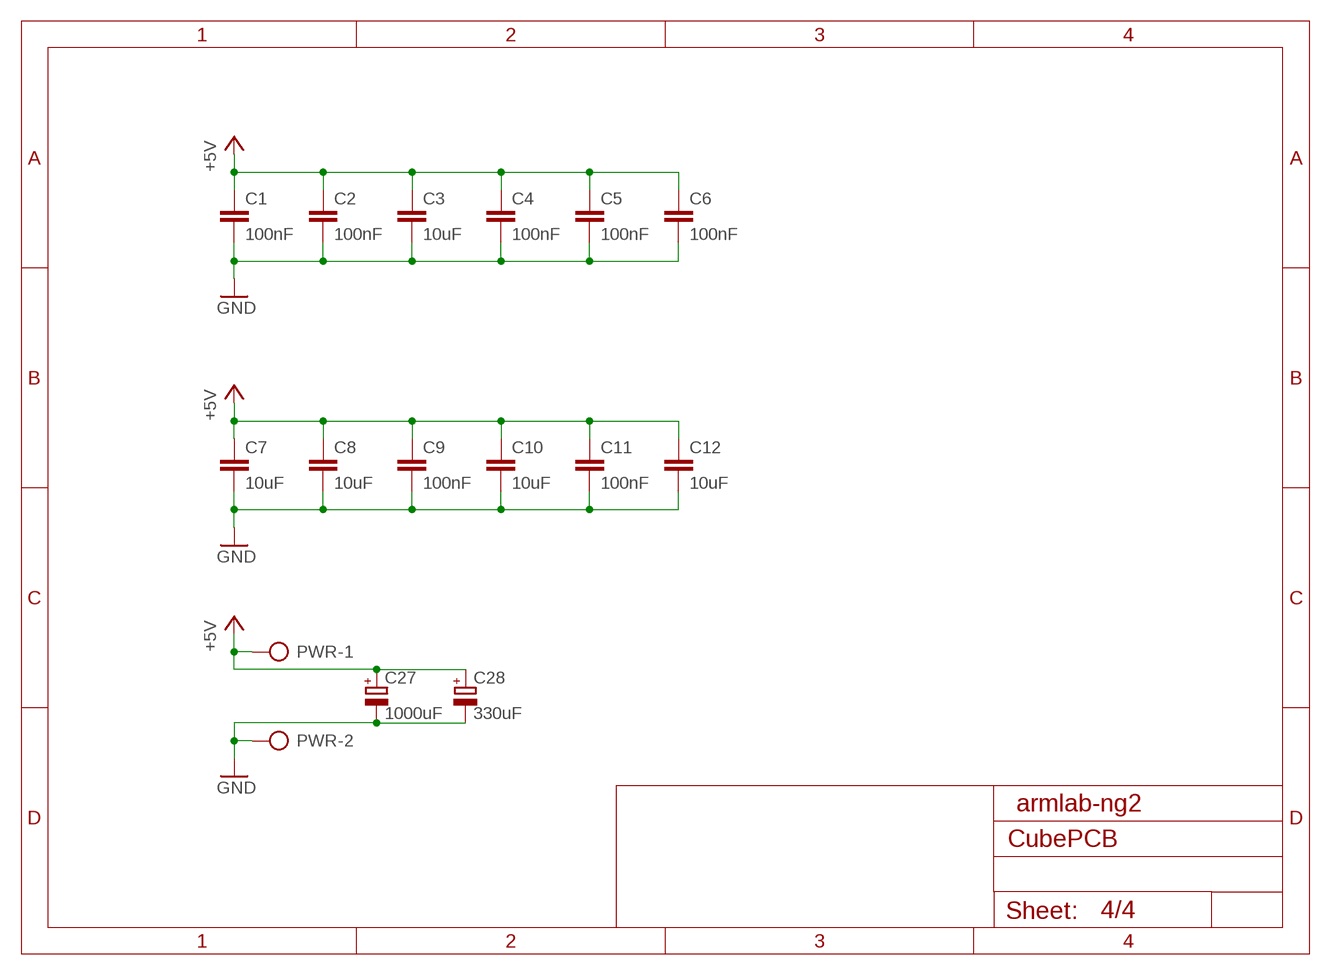
[diagram p3: schematic, sheet 4]

### Parts
C1  100nF  C-EUC0603K  [C0603K]
C2  100nF  C-EUC0603K  [C0603K]
C3  10uF  C-EUC0603K  [C0603K]
C4  100nF  C-EUC0603K  [C0603K]
C5  100nF  C-EUC0603K  [C0603K]
C6  100nF  C-EUC0603K  [C0603K]
C7  10uF  C-EUC0603K  [C0603K]
C8  10uF  C-EUC0603K  [C0603K]
C9  100nF  C-EUC0603K  [C0603K]
C10  10uF  C-EUC0603K  [C0603K]
C11  100nF  C-EUC0603K  [C0603K]
C12  10uF  C-EUC0603K  [C0603K]
C27  1000uF  CPOL-EUE5-10.5  [E5-10,5]
C28  330uF  CPOL-EUE3.5-8  [E3,5-8]
PWR  AK500/2  [AK500/2]

### Nets
+5V: C1.1 C2.1 C3.1 C4.1 C5.1 C6.1 C7.1 C8.1 C9.1 C10.1 C11.1 C12.1 C27.+ C28.+ PWR.1 ; also sheet 2
GND: C1.2 C2.2 C3.2 C4.2 C5.2 C6.2 C7.2 C8.2 C9.2 C10.2 C11.2 C12.2 C27.- C28.- PWR.2 ; also sheet 1,2,3

### Notes on the sheet
- armlab-ng2

## Library data of the parts
C1-C26 = rcl:C-EU: CAPACITOR, European symbol
C27 C28 = rcl:CPOL-EU: POLARIZED CAPACITOR, European symbol
CON1 CON2 = avnet-1:AVBUS_CONNECTOR_140-2
E1-E6 = pinhead_v2:PINHD-1X1: PIN HEADER
EBENE_1-EBENE_6 = testpad:TP: Test pad
IC1 = 74xx-eu:74*04: Hex INVERTER
PWR = con-ptr500:AK500/2: CONNECTOR; OC_FARNELL: unknown; OC_NEWARK: unknown
Q1-Q6 = transistor-fet:FDD4141: P-Channel PowerTrench® MOSFET Source: FDD4141.pdf
R1-R108 = rcl:R-EU_: RESISTOR, European symbol
RGB1-RGB36 = LedCube:LED-RGB-CA-ANODE-SPLIT
ULN1-ULN14 = SparkFun-PowerIC:ULN2803: Darlington Driver ULN2803 Darlington array. 500mA max per channel, 8-channel package. Spark Fun Electronics SKU : COM-00312